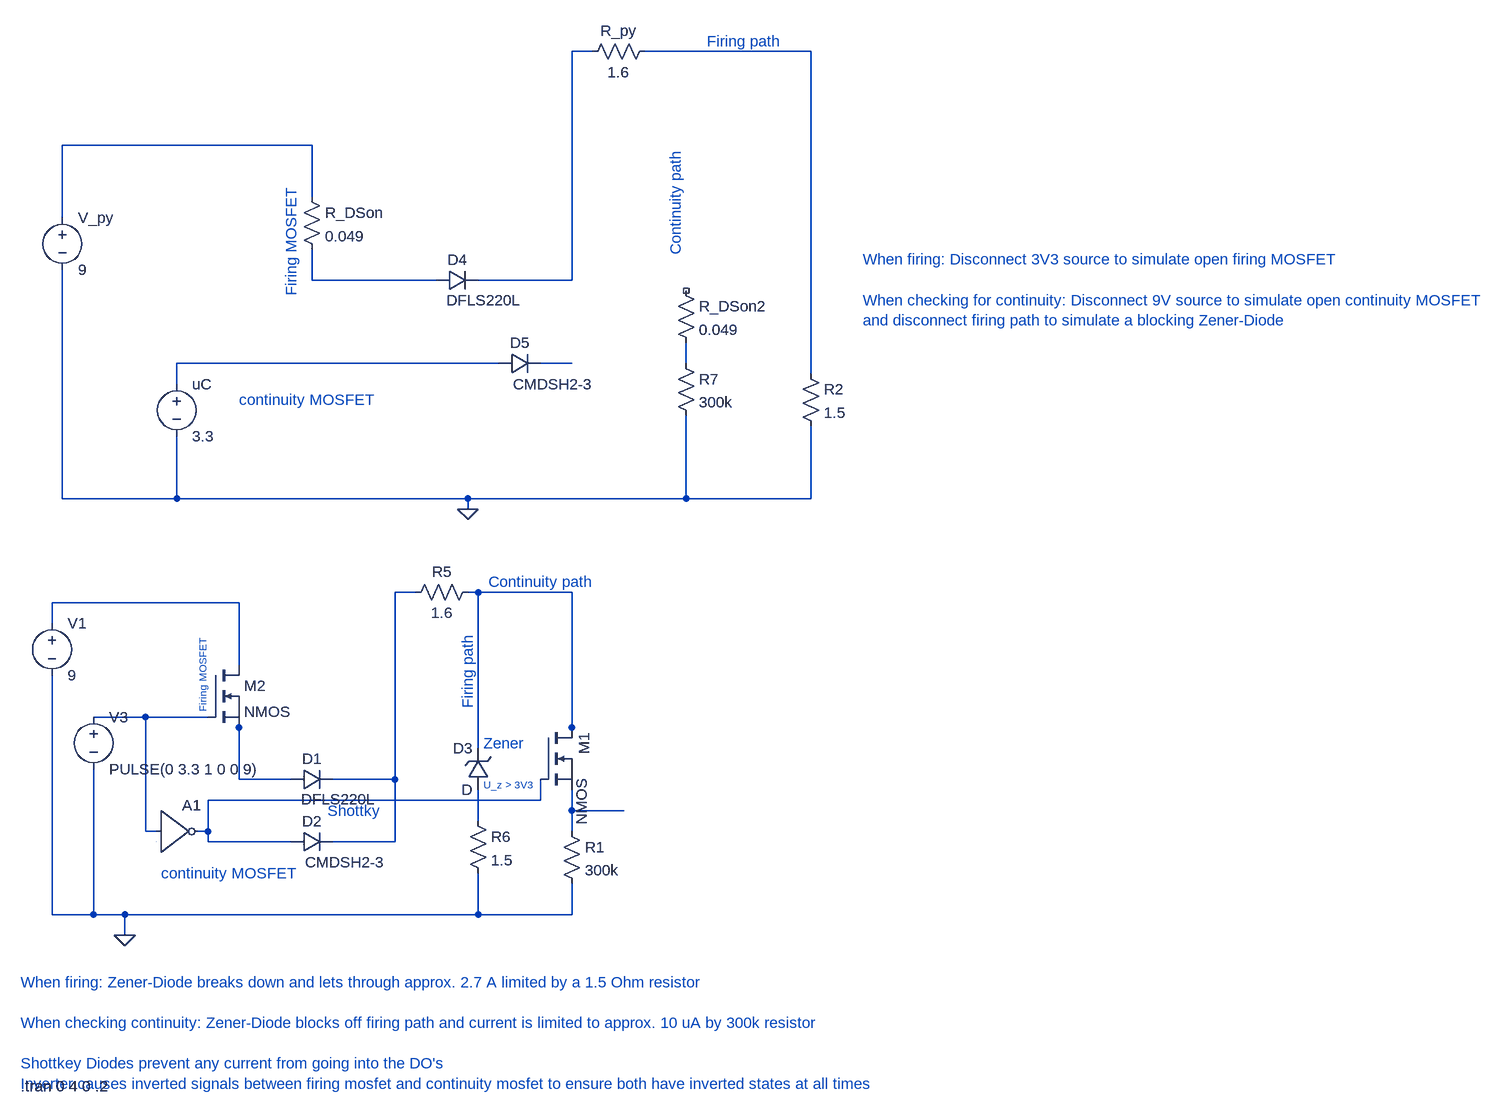
[diagram p0: schematic Kontinuitaetsmessung.asc]
Kontinuitaetsmessung.asc, the LTspice schematic file:
Version 4.1
SHEET 1 2336 680
WIRE 464 -1120 432 -1120
WIRE 800 -1120 544 -1120
WIRE 32 -976 -352 -976
WIRE 32 -896 32 -976
WIRE -352 -864 -352 -976
WIRE 32 -768 32 -816
WIRE 224 -768 32 -768
WIRE 432 -768 432 -1120
WIRE 432 -768 288 -768
WIRE 320 -640 -176 -640
WIRE 432 -640 384 -640
WIRE 608 -640 608 -672
WIRE 800 -624 800 -1120
WIRE -176 -608 -176 -640
WIRE -352 -432 -352 -784
WIRE -176 -432 -176 -528
WIRE -176 -432 -352 -432
WIRE 272 -432 -176 -432
WIRE 608 -432 608 -560
WIRE 608 -432 272 -432
WIRE 800 -432 800 -544
WIRE 800 -432 608 -432
WIRE 272 -416 272 -432
WIRE 192 -288 160 -288
WIRE 288 -288 272 -288
WIRE 432 -288 288 -288
WIRE -80 -272 -368 -272
WIRE -368 -240 -368 -272
WIRE -80 -176 -80 -272
WIRE -224 -96 -304 -96
WIRE -128 -96 -224 -96
WIRE -80 -80 -80 -96
WIRE 432 -80 432 -288
WIRE 432 -64 432 -80
WIRE 288 -48 288 -288
WIRE -80 0 -80 -80
WIRE 0 0 -80 0
WIRE 160 0 160 -288
WIRE 160 0 64 0
WIRE 384 32 384 0
WIRE 384 32 -128 32
WIRE 432 48 432 16
WIRE 512 48 432 48
WIRE 288 64 288 16
WIRE -224 80 -224 -96
WIRE -208 80 -224 80
WIRE -128 80 -128 32
WIRE -128 80 -144 80
WIRE 432 80 432 48
WIRE -128 96 -128 80
WIRE 0 96 -128 96
WIRE 160 96 160 0
WIRE 160 96 64 96
WIRE -368 208 -368 -160
WIRE -304 208 -304 -16
WIRE -304 208 -368 208
WIRE -256 208 -304 208
WIRE 288 208 288 144
WIRE 288 208 -256 208
WIRE 432 208 432 160
WIRE 432 208 288 208
WIRE -256 240 -256 208
FLAG -256 240 0
FLAG 272 -416 0
DATAFLAG 384 -288 ""
DATAFLAG 464 48 ""
SYMBOL diode 0 112 R270
WINDOW 0 32 32 VTop 2
WINDOW 3 0 83 VBottom 2
SYMATTR InstName D2
SYMATTR Value CMDSH2-3
SYMBOL voltage -368 -256 R0
WINDOW 123 0 0 Left 0
WINDOW 39 0 0 Left 0
SYMATTR InstName V1
SYMATTR Value 9
SYMBOL voltage -304 -112 R0
WINDOW 123 0 0 Left 0
WINDOW 39 0 0 Left 0
SYMATTR InstName V3
SYMATTR Value PULSE(0 3.3 1 0 0 9)
SYMBOL diode 0 16 R270
WINDOW 0 32 32 VTop 2
WINDOW 3 1 73 VBottom 2
SYMATTR InstName D1
SYMATTR Value DFLS220L
SYMBOL Digital\\inv -208 16 R0
SYMATTR InstName A1
SYMATTR SpiceLine Vhigh=3.3V,Td=5e-9,Trise=20e-9
SYMBOL voltage -352 -880 R0
WINDOW 123 0 0 Left 0
WINDOW 39 0 0 Left 0
SYMATTR InstName V_py
SYMATTR Value 9
SYMBOL voltage -176 -624 R0
WINDOW 123 0 0 Left 0
WINDOW 39 0 0 Left 0
SYMATTR InstName uC
SYMATTR Value 3.3
SYMBOL res 16 -912 R0
SYMATTR InstName R_DSon
SYMATTR Value 0.049
SYMBOL res 288 -304 R90
WINDOW 0 0 56 VBottom 2
WINDOW 3 32 56 VTop 2
SYMATTR InstName R5
SYMATTR Value 1.6
SYMBOL res 448 -1104 R270
WINDOW 0 32 56 VTop 2
WINDOW 3 0 56 VBottom 2
SYMATTR InstName R_py
SYMATTR Value 1.6
SYMBOL res 592 -768 R0
SYMATTR InstName R_DSon2
SYMATTR Value 0.049
SYMBOL diode 224 -752 R270
WINDOW 0 32 32 VTop 2
WINDOW 3 1 73 VBottom 2
SYMATTR InstName D4
SYMATTR Value DFLS220L
SYMBOL res 784 -640 R0
SYMATTR InstName R2
SYMATTR Value 1.5
SYMBOL nmos 384 -80 R0
WINDOW 0 67 8 VRight 2
WINDOW 3 63 78 VRight 2
SYMATTR InstName M1
SYMBOL nmos -128 -176 R0
SYMATTR InstName M2
SYMBOL res 272 48 R0
SYMATTR InstName R6
SYMATTR Value 1.5
SYMBOL diode 320 -624 R270
WINDOW 0 32 32 VTop 2
WINDOW 3 0 83 VBottom 2
SYMATTR InstName D5
SYMATTR Value CMDSH2-3
SYMBOL res 592 -656 R0
SYMATTR InstName R7
SYMATTR Value 300k
SYMBOL res 416 64 R0
SYMATTR InstName R1
SYMATTR Value 300k
SYMBOL zener 304 16 R180
WINDOW 0 24 64 Left 2
WINDOW 3 24 0 Left 2
SYMATTR InstName D3
TEXT 296 -56 Left 2 ;Zener
TEXT 56 48 Left 2 ;Shottky
TEXT 296 8 Left 1 ;U_z > 3V3
TEXT 640 -1136 Left 2 ;Firing path
TEXT 592 -968 VRight 2 ;Continuity path
TEXT 272 -224 VRight 2 ;Firing path
TEXT 304 -304 Left 2 ;Continuity path
TEXT -416 312 Left 2 ;When firing: Zener-Diode breaks down and lets through approx. 2.7 A limited by a 1.5 Ohm resistor\n \nWhen checking continuity: Zener-Diode blocks off firing path and current is limited to approx. 10 uA by 300k resistor\n \nShottkey Diodes prevent any current from going into the DO's\nInverter causes inverted signals between firing mosfet and continuity mosfet to ensure both have inverted states at all times
TEXT 880 -800 Left 2 ;When firing: Disconnect 3V3 source to simulate open firing MOSFET\n \nWhen checking for continuity: Disconnect 9V source to simulate open continuity MOSFET\nand disconnect firing path to simulate a blocking Zener-Diode
TEXT -80 -584 Left 2 ;continuity MOSFET
TEXT 0 -912 VRight 2 ;Firing MOSFET
TEXT -136 -216 VRight 1 ;Firing MOSFET
TEXT -200 144 Left 2 ;continuity MOSFET
TEXT -416 472 Left 2 !.tran 0 4 0 .2

The netlist it stands for:
* Kontinuitaetsmessung.asc
D2 N013 N008 CMDSH2-3
V1 N010 0 9
V3 N011 0 PULSE(0 3.3 1 0 0 9)
D1 N012 N008 DFLS220L
A1 N011 0 0 0 0 N013 0 0 BUF Vhigh=3.3V,Td=5e-9,Trise=20e-9
V_py N003 0 9
V§uC N005 0 3.3
R_DSon N003 N004 0.049
R5 N009 N008 1.6
R_py N001 N002 1.6
R_DSon2 NC_01 N007 0.049
D4 N004 N001 DFLS220L
R2 N002 0 1.5
M1 N009 N013 N014 N014 NMOS
M2 N010 N011 N012 N012 NMOS
R6 N015 0 1.5
D5 N005 N006 CMDSH2-3
R7 N007 0 300k
R1 N014 0 300k
D3 N015 N009 D
.model D D
.lib standard.dio
.model NMOS NMOS
.model PMOS PMOS
.lib standard.mos
* Zener
* Shottky
* U_z > 3V3
* Firing path
* Continuity path
* Firing path
* Continuity path
* When firing: Zener-Diode breaks down and lets through approx. 2.7 A limited by a 1.5 Ohm resistor
* When checking continuity: Zener-Diode blocks off firing path and current is limited to approx. 10 uA by 300k resistor
* Shottkey Diodes prevent any current from going into the DO's
* Inverter causes inverted signals between firing mosfet and continuity mosfet to ensure both have inverted states at all times
* When firing: Disconnect 3V3 source to simulate open firing MOSFET
* When checking for continuity: Disconnect 9V source to simulate open continuity MOSFET
* and disconnect firing path to simulate a blocking Zener-Diode
* continuity MOSFET
* Firing MOSFET
* Firing MOSFET
* continuity MOSFET
.tran 0 4 0 .2
.backanno
.end